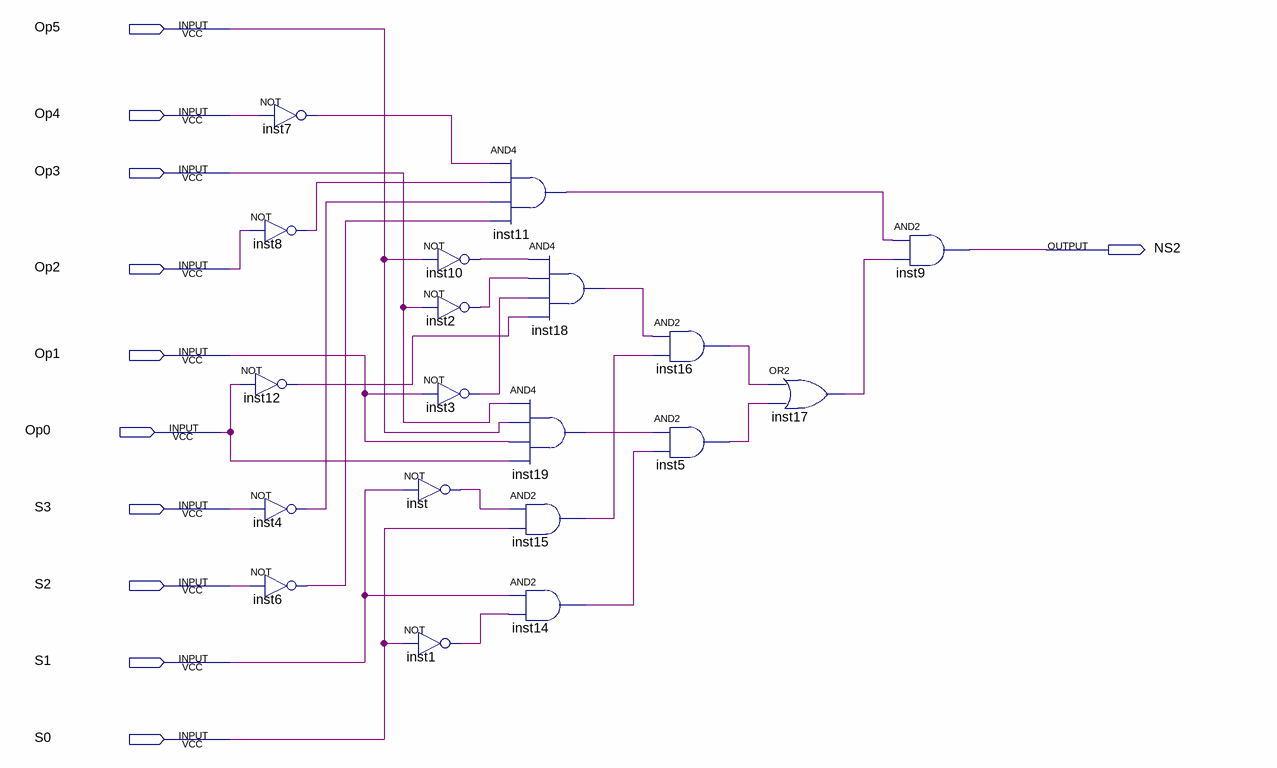
[diagram p0: schematic sheet]
// Quartus schematic NS2.bdf as structural Verilog: 19 symbols, 11 pins
module NS2 (
  input  Op5,
  input  Op4,
  input  Op3,
  input  Op2,
  input  Op1,
  input  Op0,
  input  S3,
  input  S2,
  input  S1,
  input  S0,
  output NS2
);

  wire inst1_out, inst2_out, inst3_out, inst4_out, inst5_out, inst6_out, inst7_out, inst8_out, inst10_out,
       inst11_out, inst12_out, inst14_out, inst15_out, inst16_out, inst17_out, inst18_out, inst19_out,
       inst_out;

  not inst7 (inst7_out, Op4);
  not inst8 (inst8_out, Op2);
  not inst12 (inst12_out, Op0);
  not inst4 (inst4_out, S3);
  not inst6 (inst6_out, S2);
  not inst10 (inst10_out, Op5);
  not inst2 (inst2_out, Op3);
  not inst3 (inst3_out, Op1);
  not inst (inst_out, S1);
  not inst1 (inst1_out, S0);
  and inst11 (inst11_out, inst7_out, inst8_out, inst4_out, inst6_out);
  and inst18 (inst18_out, inst10_out, inst2_out, inst3_out, inst12_out);
  and inst19 (inst19_out, Op3, Op5, Op1, Op0);
  and inst15 (inst15_out, inst_out, S0);
  and inst14 (inst14_out, S1, inst1_out);
  and inst16 (inst16_out, inst18_out, inst15_out);
  and inst5 (inst5_out, inst19_out, inst14_out);
  or inst17 (inst17_out, inst16_out, inst5_out);
  and inst9 (NS2, inst11_out, inst17_out);
endmodule
